# Altium schematic sheet pcbthing.SchDoc
size C; SheetNumber: 1; SheetTotal: 1
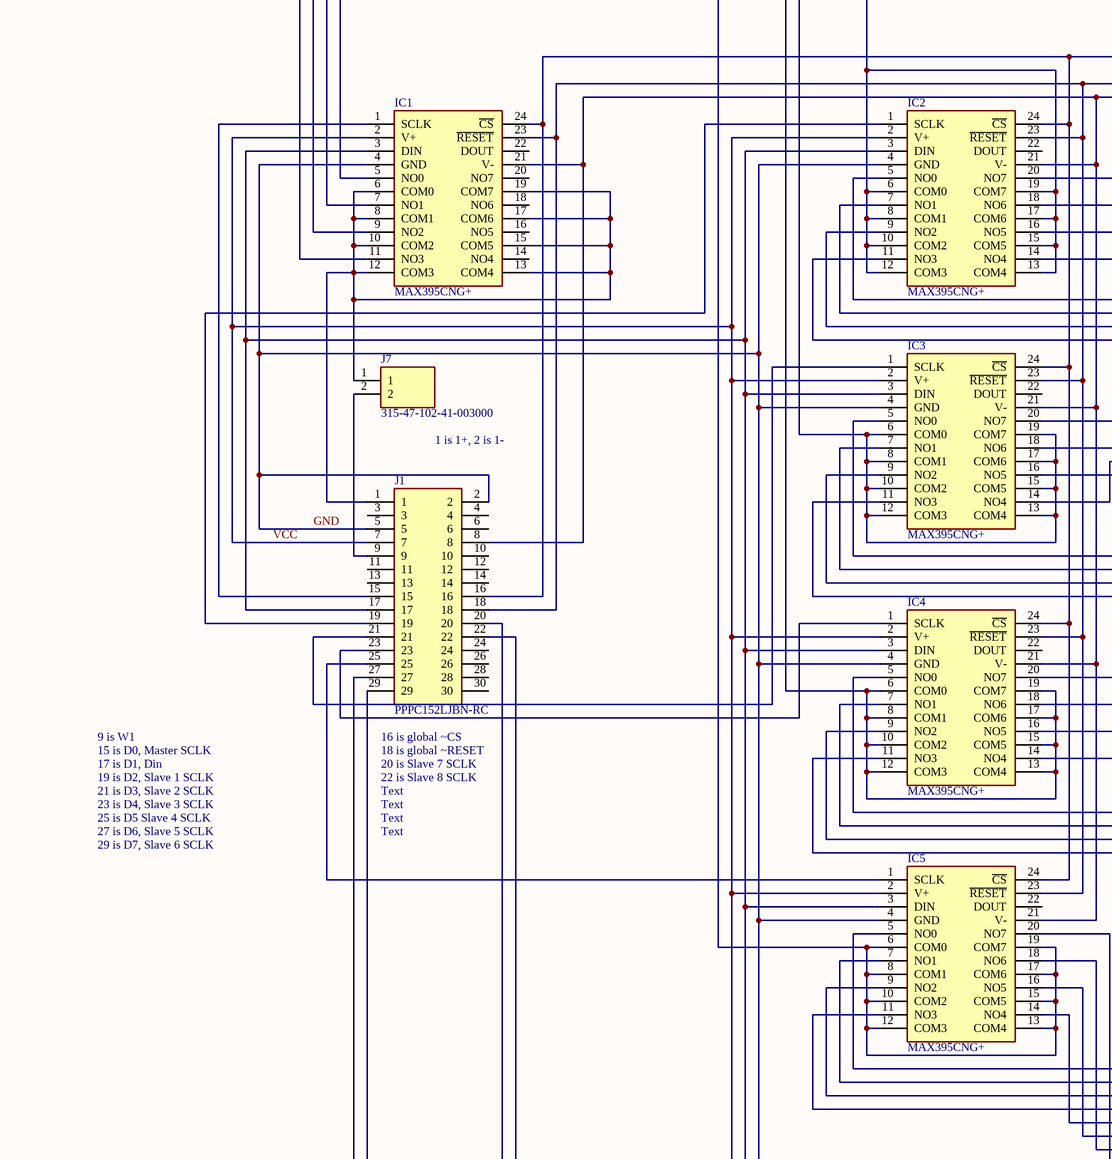
[diagram p0: pcbthing.SchDoc, left]
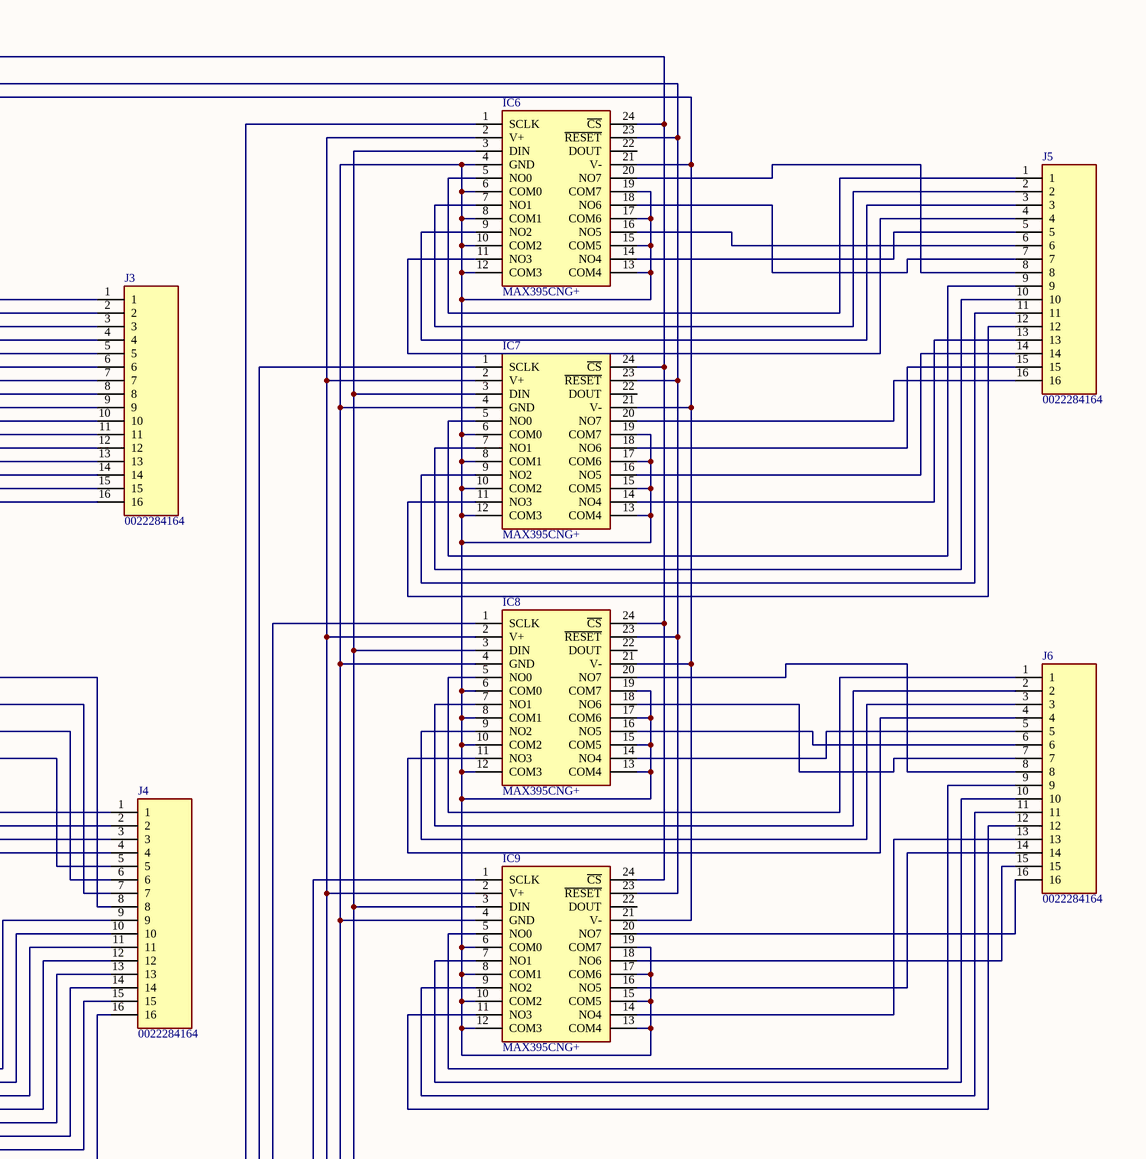
[diagram p1: pcbthing.SchDoc, right]

## Parts
IC1  MAX395CNG+  [DIP794W56P254L3054H457Q24N]
IC2  MAX395CNG+  [DIP794W56P254L3054H457Q24N]
IC3  MAX395CNG+  [DIP794W56P254L3054H457Q24N]
IC4  MAX395CNG+  [DIP794W56P254L3054H457Q24N]
IC5  MAX395CNG+  [DIP794W56P254L3054H457Q24N]
IC6  MAX395CNG+  [DIP794W56P254L3054H457Q24N]
IC7  MAX395CNG+  [DIP794W56P254L3054H457Q24N]
IC8  MAX395CNG+  [DIP794W56P254L3054H457Q24N]
IC9  MAX395CNG+  [DIP794W56P254L3054H457Q24N]
J1  PPPC152LJBN-RC  [RHDRRA30W60P254X254_2X15_3860X850X528P]
J3  0022284164  [HDRV16W66P0X254_1X16_4064X249X1041P]
J4  0022284164  [HDRV16W66P0X254_1X16_4064X249X1041P]
J5  0022284164  [HDRV16W66P0X254_1X16_4064X249X1041P]
J6  0022284164  [HDRV16W66P0X254_1X16_4064X249X1041P]
J7  315-47-102-41-003000  [3154710241003000]

## Nets
GND: IC1.4(GND) IC2.4(GND) IC3.4(GND) IC4.4(GND) IC5.4(GND) IC6.4(GND) IC6.6(COM0) IC6.8(COM1) IC6.10(COM2) IC6.12(COM3) IC6.13(COM4) IC6.15(COM5) IC6.17(COM6) IC6.19(COM7) IC7.4(GND) IC7.6(COM0) IC7.8(COM1) IC7.10(COM2) IC7.12(COM3) IC7.13(COM4) IC7.15(COM5) IC7.17(COM6) IC7.19(COM7) IC8.4(GND) IC8.6(COM0) IC8.8(COM1) IC8.10(COM2) IC8.12(COM3) IC8.13(COM4) IC8.15(COM5) IC8.17(COM6) IC8.19(COM7) IC9.4(GND) IC9.6(COM0) IC9.8(COM1) IC9.10(COM2) IC9.12(COM3) IC9.13(COM4) IC9.15(COM5) IC9.17(COM6) IC9.19(COM7) J1.2 J1.5
VCC: IC1.2(V+) IC2.2(V+) IC3.2(V+) IC4.2(V+) IC5.2(V+) IC6.2(V+) IC7.2(V+) IC8.2(V+) IC9.2(V+) J1.7
NetIC1_1: IC1.1(SCLK) J1.15
NetIC1_3: IC1.3(DIN) IC2.3(DIN) IC3.3(DIN) IC4.3(DIN) IC5.3(DIN) IC6.3(DIN) IC7.3(DIN) IC8.3(DIN) IC9.3(DIN) J1.17
NetIC1_5: IC1.5(NO0) IC2.6(COM0) IC2.8(COM1) IC2.10(COM2) IC2.12(COM3) IC2.13(COM4) IC2.15(COM5) IC2.17(COM6) IC2.19(COM7)
NetIC1_6: IC1.6(COM0) IC1.8(COM1) IC1.10(COM2) IC1.12(COM3) IC1.13(COM4) IC1.15(COM5) IC1.17(COM6) IC1.19(COM7) J1.1 J7.1
NetIC1_7: IC1.7(NO1) IC3.6(COM0) IC3.8(COM1) IC3.10(COM2) IC3.12(COM3) IC3.13(COM4) IC3.15(COM5) IC3.17(COM6) IC3.19(COM7)
NetIC1_9: IC1.9(NO2) IC4.6(COM0) IC4.8(COM1) IC4.10(COM2) IC4.12(COM3) IC4.13(COM4) IC4.15(COM5) IC4.17(COM6) IC4.19(COM7)
NetIC1_11: IC1.11(NO3) IC5.6(COM0) IC5.8(COM1) IC5.10(COM2) IC5.12(COM3) IC5.13(COM4) IC5.15(COM5) IC5.17(COM6) IC5.19(COM7)
NetIC1_21: IC1.21(V-) IC2.21(V-) IC3.21(V-) IC4.21(V-) IC5.21(V-) IC6.21(V-) IC7.21(V-) IC8.21(V-) IC9.21(V-) J1.8
NetIC1_23: IC1.23(~{RESET}) IC2.23(~{RESET}) IC3.23(~{RESET}) IC4.23(~{RESET}) IC5.23(~{RESET}) IC6.23(~{RESET}) IC7.23(~{RESET}) IC8.23(~{RESET}) IC9.23(~{RESET}) J1.18
NetIC1_24: IC1.24(~{CS}) IC2.24(~{CS}) IC3.24(~{CS}) IC4.24(~{CS}) IC5.24(~{CS}) IC6.24(~{CS}) IC7.24(~{CS}) IC8.24(~{CS}) IC9.24(~{CS}) J1.16
NetIC2_1: IC2.1(SCLK) J1.19
NetIC2_5: IC2.5(NO0) J3.1
NetIC2_7: IC2.7(NO1) J3.2
NetIC2_9: IC2.9(NO2) J3.3
NetIC2_11: IC2.11(NO3) J3.4
NetIC2_14: IC2.14(NO4) J3.5
NetIC2_16: IC2.16(NO5) J3.6
NetIC2_18: IC2.18(NO6) J3.7
NetIC2_20: IC2.20(NO7) J3.8
NetIC3_1: IC3.1(SCLK) J1.21
NetIC3_5: IC3.5(NO0) J3.9
NetIC3_7: IC3.7(NO1) J3.10
NetIC3_9: IC3.9(NO2) J3.11
NetIC3_11: IC3.11(NO3) J3.12
NetIC3_14: IC3.14(NO4) J3.13
NetIC3_16: IC3.16(NO5) J3.14
NetIC3_18: IC3.18(NO6) J3.15
NetIC3_20: IC3.20(NO7) J3.16
NetIC4_1: IC4.1(SCLK) J1.23
NetIC4_5: IC4.5(NO0) J4.1
NetIC4_7: IC4.7(NO1) J4.2
NetIC4_9: IC4.9(NO2) J4.3
NetIC4_11: IC4.11(NO3) J4.4
NetIC4_14: IC4.14(NO4) J4.5
NetIC4_16: IC4.16(NO5) J4.6
NetIC4_18: IC4.18(NO6) J4.7
NetIC4_20: IC4.20(NO7) J4.8
NetIC5_1: IC5.1(SCLK) J1.25
NetIC5_5: IC5.5(NO0) J4.9
NetIC5_7: IC5.7(NO1) J4.10
NetIC5_9: IC5.9(NO2) J4.11
NetIC5_11: IC5.11(NO3) J4.12
NetIC5_14: IC5.14(NO4) J4.13
NetIC5_16: IC5.16(NO5) J4.14
NetIC5_18: IC5.18(NO6) J4.15
NetIC5_20: IC5.20(NO7) J4.16
NetIC6_1: IC6.1(SCLK) J1.27
NetIC6_5: IC6.5(NO0) J5.1
NetIC6_7: IC6.7(NO1) J5.2
NetIC6_9: IC6.9(NO2) J5.3
NetIC6_11: IC6.11(NO3) J5.4
NetIC6_14: IC6.14(NO4) J5.5
NetIC6_16: IC6.16(NO5) J5.6
NetIC6_18: IC6.18(NO6) J5.7
NetIC6_20: IC6.20(NO7) J5.8
NetIC7_1: IC7.1(SCLK) J1.29
NetIC7_5: IC7.5(NO0) J5.9
NetIC7_7: IC7.7(NO1) J5.10
NetIC7_9: IC7.9(NO2) J5.11
NetIC7_11: IC7.11(NO3) J5.12
NetIC7_14: IC7.14(NO4) J5.13
NetIC7_16: IC7.16(NO5) J5.14
NetIC7_18: IC7.18(NO6) J5.15
NetIC7_20: IC7.20(NO7) J5.16
NetIC8_1: IC8.1(SCLK) J1.20
NetIC8_5: IC8.5(NO0) J6.1
NetIC8_7: IC8.7(NO1) J6.2
NetIC8_9: IC8.9(NO2) J6.3
NetIC8_11: IC8.11(NO3) J6.4
NetIC8_14: IC8.14(NO4) J6.5
NetIC8_16: IC8.16(NO5) J6.6
NetIC8_18: IC8.18(NO6) J6.7
NetIC8_20: IC8.20(NO7) J6.8
NetIC9_1: IC9.1(SCLK) J1.22
NetIC9_5: IC9.5(NO0) J6.9
NetIC9_7: IC9.7(NO1) J6.10
NetIC9_9: IC9.9(NO2) J6.11
NetIC9_11: IC9.11(NO3) J6.12
NetIC9_14: IC9.14(NO4) J6.13
NetIC9_16: IC9.16(NO5) J6.14
NetIC9_18: IC9.18(NO6) J6.15
NetIC9_20: IC9.20(NO7) J6.16
NetJ1_9: J1.9 J7.2

Not connected (* = marked no-connect by the designer): IC1 14(NO4) 16(NO5) 18(NO6) 20(NO7) 22(DOUT); IC2 22(DOUT); IC3 22(DOUT); IC4 22(DOUT); IC5 22(DOUT); IC6 22(DOUT); IC7 22(DOUT); IC8 22(DOUT); IC9 22(DOUT); J1 3 4 6 10 11 12 13 14 24 26 28 30

## Notes on the sheet
- 1 is 1+, 2 is 1-
- 9 is W1
- 15 is D0, Master SCLK
- 17 is D1, Din
- 19 is D2, Slave 1 SCLK
- 21 is D3, Slave 2 SCLK
- (near J1) 16 is global ~CS
- 18 is global ~RESET
- 20 is Slave 7 SCLK
- 22 is Slave 8 SCLK
- Text
- 23 is D4, Slave 3 SCLK
- 25 is D5 Slave 4 SCLK
- 27 is D6, Slave 5 SCLK
- 29 is D7, Slave 6 SCLK

## Library data of the parts
IC1-IC9 = MAX395CNG+: Integrated Circuit; Manufacturer_Name: Analog Devices; Datasheet Link: https://datasheet.datasheetarchive.com/originals/distributors/SFDatasheet-4/sf-00086530.pdf; Height: 4.572mm; Manufacturer_Part_Number: MAX395CNG+; Mouser Part Number: 700-MAX395CNG; Mouser Price/Stock: https://www.mouser.co.uk/ProductDetail/Maxim-Integrated/MAX395CNG%2b?qs=LHmEVA8xxfY2%2FNLn9d%2F0zg%3D%3D
J1 = PPPC152LJBN-RC: Connector; Manufacturer_Name: Sullins; Datasheet Link: http://sullinscorp.com/drawings/101_P(N)PxCxx2LJBN-RC,_10494-H.pdf; Height: 5.28mm; Manufacturer_Part_Number: PPPC152LJBN-RC
J3-J6 = 0022284164: Connector; Manufacturer_Name: Molex; Datasheet Link: https://g.componentsearchengine.com/Datasheets/1/0022284164.pdf; Height: 10.41mm; Manufacturer_Part_Number: 0022284164; Mouser Part Number: N/A; Mouser Price/Stock: https://www.mouser.com/Search/Refine.aspx?Keyword=N%2FA; Arrow Part Number: 0022284164; Arrow Price/Stock: https://www.arrow.com/en/products/0022284164/molex
J7 = 315-47-102-41-003000: Connector; Manufacturer_Name: Mill-Max; Datasheet Link: https://datasheet.datasheetarchive.com/originals/distributors/DKDS-31/604690.pdf; Height: 3.0988mm; Manufacturer_Part_Number: 315-47-102-41-003000; Mouser Part Number: 575-3154710241003000; Mouser Price/Stock: https://www.mouser.com/Search/Refine.aspx?Keyword=575-3154710241003000; Arrow Part Number: 315-47-102-41-003000; Arrow Price/Stock: https://www.arrow.com/en/products/315-47-102-41-003000/mill-max